# Altium schematic sheet SingleBoardDrone_Act.SchDoc
size C; SheetNumber: 3; SheetTotal: 5
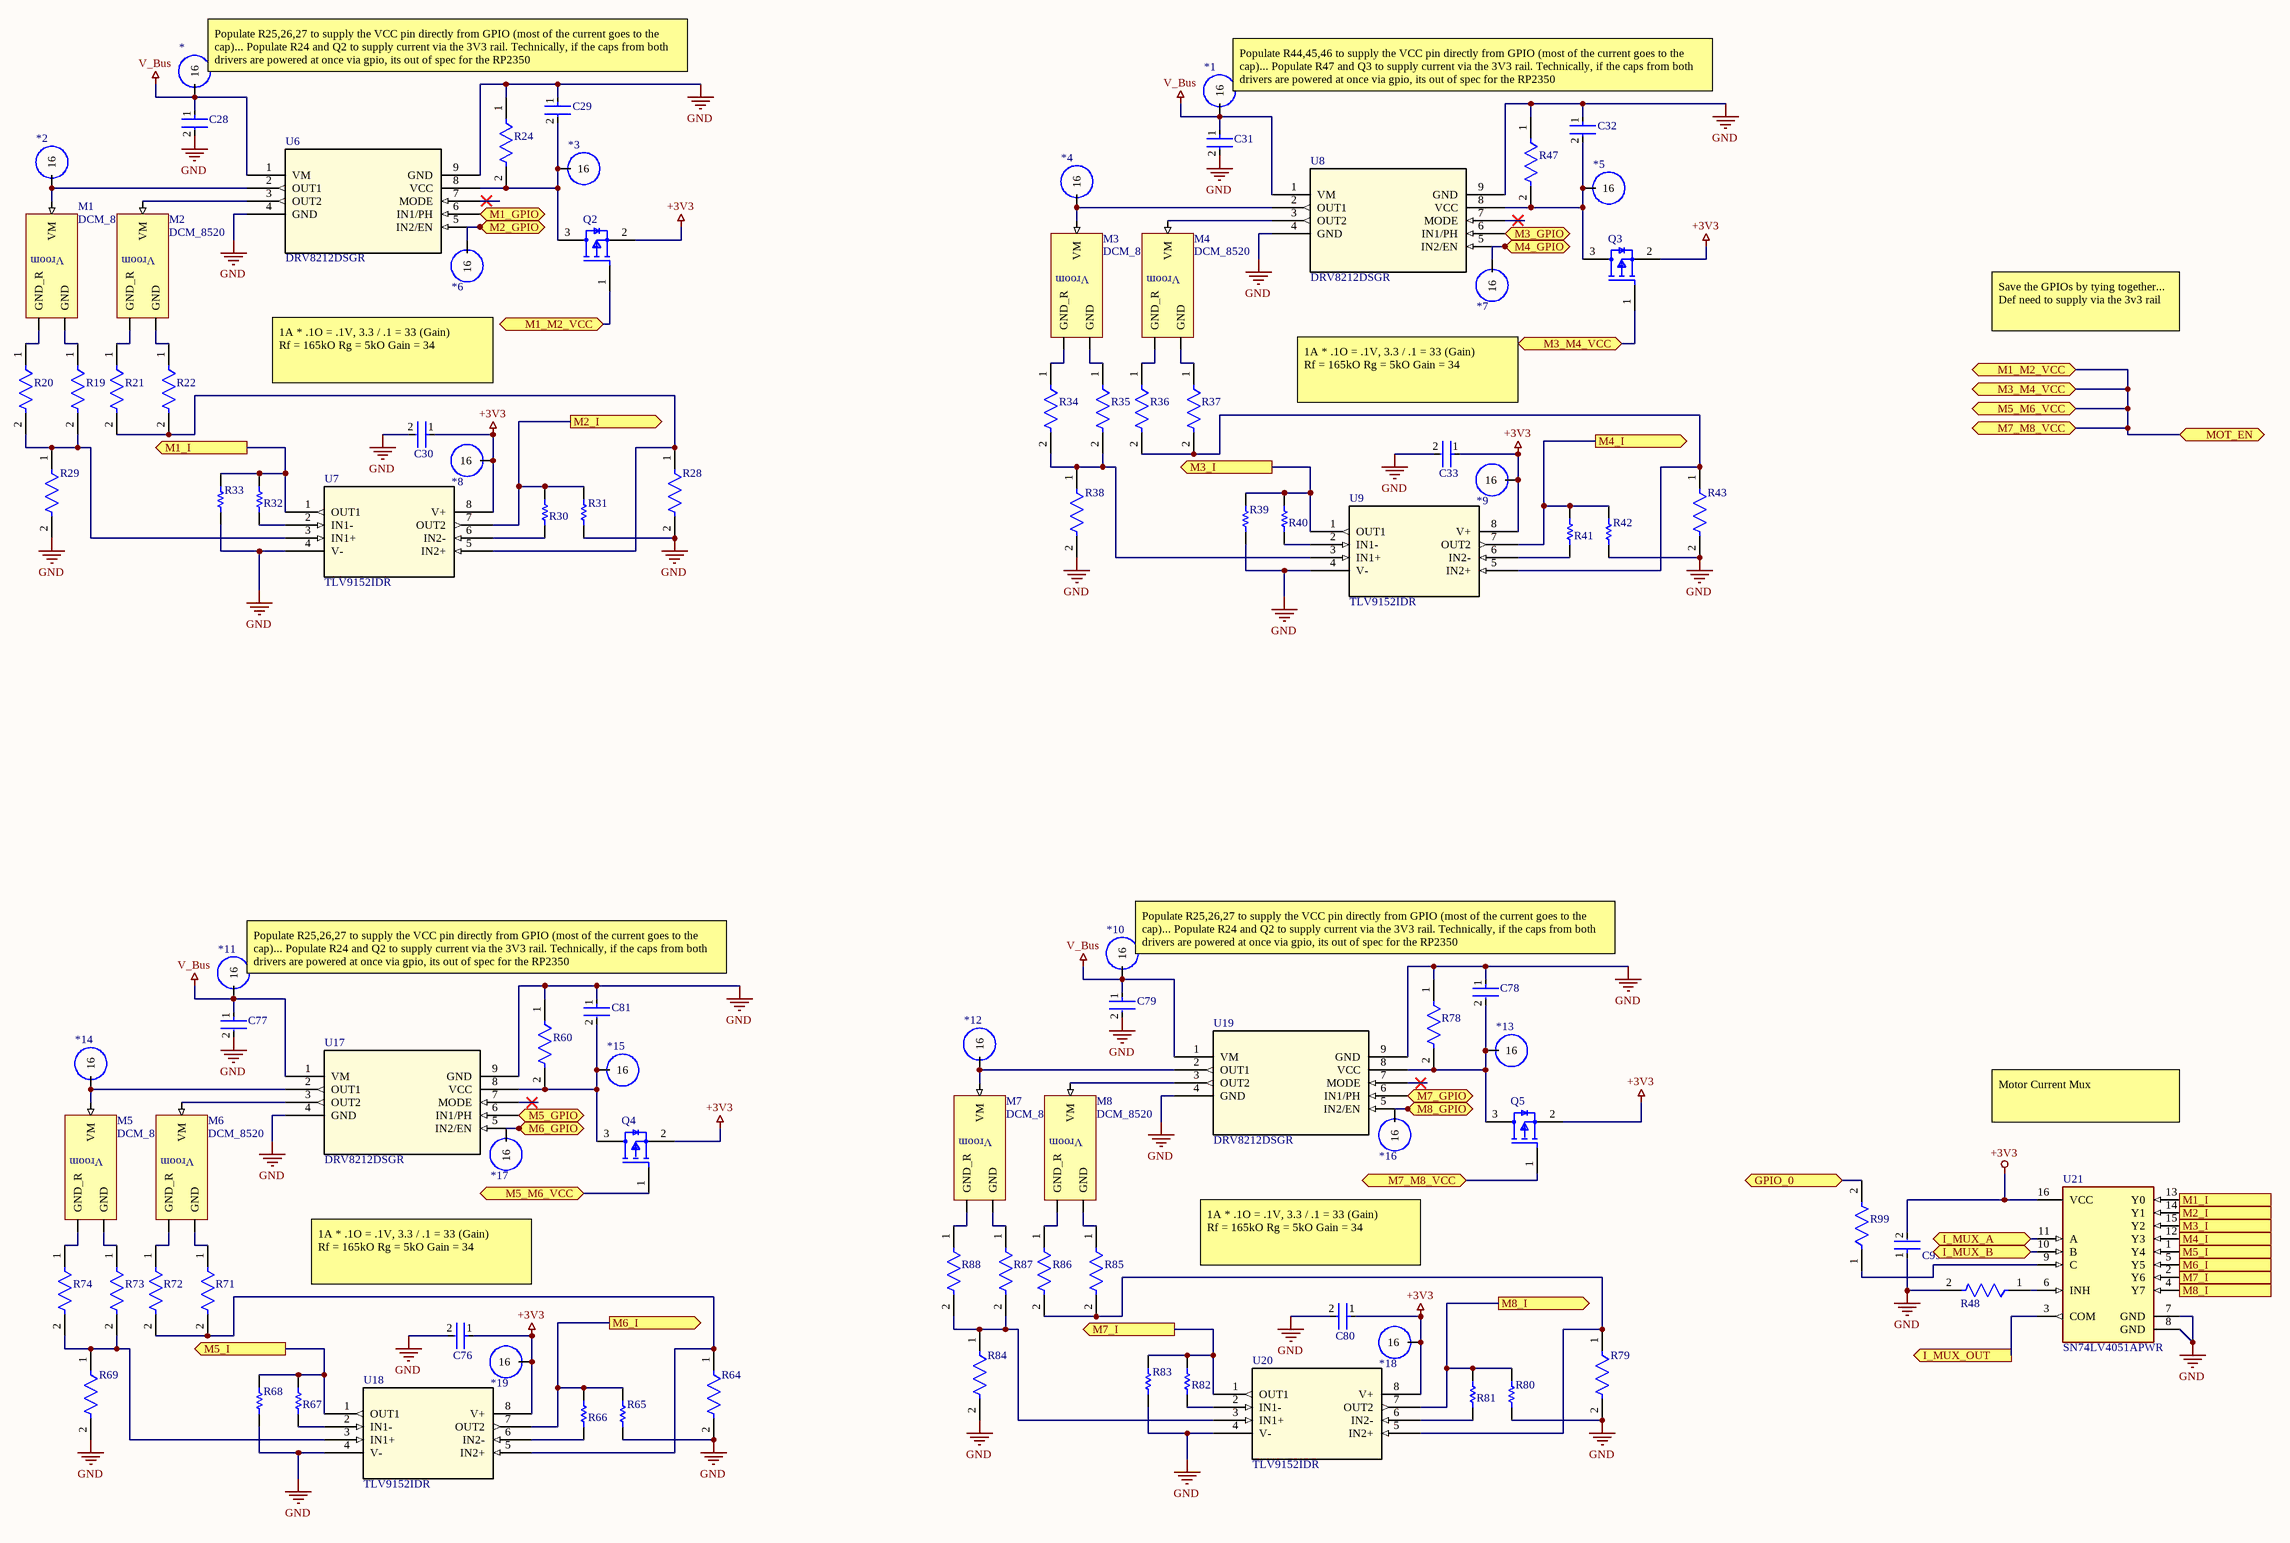
[diagram p0: SingleBoardDrone_Act.SchDoc]

## Parts
*  Component_1  [Test_Point]  (value not drawn)  (no BOM)
*1  Component_1  [Test_Point]  (value not drawn)  (no BOM)
*2  Component_1  [Test_Point]  (value not drawn)  (no BOM)
*3  Component_1  [Test_Point]  (value not drawn)  (no BOM)
*4  Component_1  [Test_Point]  (value not drawn)  (no BOM)
*5  Component_1  [Test_Point]  (value not drawn)  (no BOM)
*6  Component_1  [Test_Point]  (value not drawn)  (no BOM)
*7  Component_1  [Test_Point]  (value not drawn)  (no BOM)
*8  Component_1  [Test_Point]  (value not drawn)  (no BOM)
*9  Component_1  [Test_Point]  (value not drawn)  (no BOM)
*10  Component_1  [Test_Point]  (value not drawn)  (no BOM)
*11  Component_1  [Test_Point]  (value not drawn)  (no BOM)
*12  Component_1  [Test_Point]  (value not drawn)  (no BOM)
*13  Component_1  [Test_Point]  (value not drawn)  (no BOM)
*14  Component_1  [Test_Point]  (value not drawn)  (no BOM)
*15  Component_1  [Test_Point]  (value not drawn)  (no BOM)
*16  Component_1  [Test_Point]  (value not drawn)  (no BOM)
*17  Component_1  [Test_Point]  (value not drawn)  (no BOM)
*18  Component_1  [Test_Point]  (value not drawn)  (no BOM)
*19  Component_1  [Test_Point]  (value not drawn)  (no BOM)
C28  CL03A104KP3NNNC  [FP-CL03-IPC_C]  (value not drawn)
C29  CL03A104KP3NNNC  [FP-CL03-IPC_C]  (value not drawn)
C30  CL03A104KP3NNNC  [FP-CL03-IPC_C]  (value not drawn)
C31  CL03A104KP3NNNC  [FP-CL03-IPC_C]  (value not drawn)
C32  CL03A104KP3NNNC  [FP-CL03-IPC_C]  (value not drawn)
C33  CL03A104KP3NNNC  [FP-CL03-IPC_C]  (value not drawn)
C76  CL03A104KP3NNNC  [FP-CL03-IPC_C]  (value not drawn)
C77  CL03A104KP3NNNC  [FP-CL03-IPC_C]  (value not drawn)
C78  CL03A104KP3NNNC  [FP-CL03-IPC_C]  (value not drawn)
C79  CL03A104KP3NNNC  [FP-CL03-IPC_C]  (value not drawn)
C80  CL03A104KP3NNNC  [FP-CL03-IPC_C]  (value not drawn)
C81  CL03A104KP3NNNC  [FP-CL03-IPC_C]  (value not drawn)
C99  CL03A104KP3NNNC  [FP-CL03-IPC_C]  (value not drawn)
M1  DCM_8520  [PCBComponent_1]  (no BOM)
M2  DCM_8520  [PCBComponent_1]  (no BOM)
M3  DCM_8520  [PCBComponent_1]  (no BOM)
M4  DCM_8520  [PCBComponent_1]  (no BOM)
M5  DCM_8520  [PCBComponent_1]  (no BOM)
M6  DCM_8520  [PCBComponent_1]  (no BOM)
M7  DCM_8520  [PCBComponent_1]  (no BOM)
M8  DCM_8520  [PCBComponent_1]  (no BOM)
Q2  DMG2305UX-7  [FP-SOT23-IPC_B]  (value not drawn)
Q3  DMG2305UX-7  [FP-SOT23-IPC_B]  (value not drawn)
Q4  DMG2305UX-7  [FP-SOT23-IPC_B]  (value not drawn)
Q5  DMG2305UX-7  [FP-SOT23-IPC_B]  (value not drawn)
R19  RC0402FR-070RL  [FP-RC0402-0_4-IPC_A]  (value not drawn)
R20  RC0402FR-070RL  [FP-RC0402-0_4-IPC_A]  (value not drawn)
R21  RC0402FR-070RL  [FP-RC0402-0_4-IPC_A]  (value not drawn)
R22  RC0402FR-070RL  [FP-RC0402-0_4-IPC_A]  (value not drawn)
R24  RMCF0603JG10K0  [FP-RMCF0603-MFG]  (value not drawn)
R28  ERJ-3RSFR10V  [FP-ERJ3R-MFG]  (value not drawn)
R29  ERJ-3RSFR10V  [FP-ERJ3R-MFG]  (value not drawn)
R30  ERJ-3EKF1653V  [RESC1608X55X30LL15T15]  (value not drawn)
R31  CRCW08055K00FKTA  [RESC2013X50X30ML20T20]  (value not drawn)
R32  ERJ-3EKF1653V  [RESC1608X55X30LL15T15]  (value not drawn)
R33  CRCW08055K00FKTA  [RESC2013X50X30ML20T20]  (value not drawn)
R34  RC0402FR-070RL  [FP-RC0402-0_4-IPC_A]  (value not drawn)
R35  RC0402FR-070RL  [FP-RC0402-0_4-IPC_A]  (value not drawn)
R36  RC0402FR-070RL  [FP-RC0402-0_4-IPC_A]  (value not drawn)
R37  RC0402FR-070RL  [FP-RC0402-0_4-IPC_A]  (value not drawn)
R38  ERJ-3RSFR10V  [FP-ERJ3R-MFG]  (value not drawn)
R39  CRCW08055K00FKTA  [RESC2013X50X30ML20T20]  (value not drawn)
R40  ERJ-3EKF1653V  [RESC1608X55X30LL15T15]  (value not drawn)
R41  ERJ-3EKF1653V  [RESC1608X55X30LL15T15]  (value not drawn)
R42  CRCW08055K00FKTA  [RESC2013X50X30ML20T20]  (value not drawn)
R43  ERJ-3RSFR10V  [FP-ERJ3R-MFG]  (value not drawn)
R47  RMCF0603JG10K0  [FP-RMCF0603-MFG]  (value not drawn)
R48  RC0402FR-070RL  [FP-RC0402-0_4-IPC_A]  (value not drawn)
R60  RMCF0603JG10K0  [FP-RMCF0603-MFG]  (value not drawn)
R64  ERJ-3RSFR10V  [FP-ERJ3R-MFG]  (value not drawn)
R65  CRCW08055K00FKTA  [RESC2013X50X30ML20T20]  (value not drawn)
R66  ERJ-3EKF1653V  [RESC1608X55X30LL15T15]  (value not drawn)
R67  ERJ-3EKF1653V  [RESC1608X55X30LL15T15]  (value not drawn)
R68  CRCW08055K00FKTA  [RESC2013X50X30ML20T20]  (value not drawn)
R69  ERJ-3RSFR10V  [FP-ERJ3R-MFG]  (value not drawn)
R71  RC0402FR-070RL  [FP-RC0402-0_4-IPC_A]  (value not drawn)
R72  RC0402FR-070RL  [FP-RC0402-0_4-IPC_A]  (value not drawn)
R73  RC0402FR-070RL  [FP-RC0402-0_4-IPC_A]  (value not drawn)
R74  RC0402FR-070RL  [FP-RC0402-0_4-IPC_A]  (value not drawn)
R78  RMCF0603JG10K0  [FP-RMCF0603-MFG]  (value not drawn)
R79  ERJ-3RSFR10V  [FP-ERJ3R-MFG]  (value not drawn)
R80  CRCW08055K00FKTA  [RESC2013X50X30ML20T20]  (value not drawn)
R81  ERJ-3EKF1653V  [RESC1608X55X30LL15T15]  (value not drawn)
R82  ERJ-3EKF1653V  [RESC1608X55X30LL15T15]  (value not drawn)
R83  CRCW08055K00FKTA  [RESC2013X50X30ML20T20]  (value not drawn)
R84  ERJ-3RSFR10V  [FP-ERJ3R-MFG]  (value not drawn)
R85  RC0402FR-070RL  [FP-RC0402-0_4-IPC_A]  (value not drawn)
R86  RC0402FR-070RL  [FP-RC0402-0_4-IPC_A]  (value not drawn)
R87  RC0402FR-070RL  [FP-RC0402-0_4-IPC_A]  (value not drawn)
R88  RC0402FR-070RL  [FP-RC0402-0_4-IPC_A]  (value not drawn)
R99  RC0402FR-070RL  [FP-RC0402-0_4-IPC_A]  (value not drawn)
U6  DRV8212DSGR  [WSON_212DSGR_TEX]
U7  TLV9152IDR  [SOIC8_D_TEX]
U8  DRV8212DSGR  [WSON_212DSGR_TEX]
U9  TLV9152IDR  [SOIC8_D_TEX]
U17  DRV8212DSGR  [WSON_212DSGR_TEX]
U18  TLV9152IDR  [SOIC8_D_TEX]
U19  DRV8212DSGR  [WSON_212DSGR_TEX]
U20  TLV9152IDR  [SOIC8_D_TEX]
U21  SN74LV4051APWR  [FP-PW0016A-MFG]

## Ports
GPIO_0 (bidir, see SingleBoardDrone_RP2350[1A], SingleBoardDrone_RP2350[2C]), I_MUX_A (bidir, see SingleBoardDrone_RP2350[1A]), I_MUX_B (bidir, see SingleBoardDrone_RP2350[3B]), I_MUX_OUT (out, see SingleBoardDrone_RP2350[3B]), M1_GPIO (bidir, see SingleBoardDrone_RP2350[1A]), M1_I (out, see SingleBoardDrone_Act[1B]), M1_I (out, see SingleBoardDrone_Act[6C]), M1_M2_VCC (bidir, see SingleBoardDrone_Act[2A]), M1_M2_VCC (bidir, see SingleBoardDrone_Act[5A]), M2_GPIO (bidir, see SingleBoardDrone_RP2350[1A]), M2_I (out, see SingleBoardDrone_Act[2B]), M2_I (out, see SingleBoardDrone_Act[6C]), M3_GPIO (bidir, see SingleBoardDrone_RP2350[1B]), M3_I (out, see SingleBoardDrone_Act[3B]), M3_I (out, see SingleBoardDrone_Act[6C]), M3_M4_VCC (bidir, see SingleBoardDrone_Act[4A]), M3_M4_VCC (bidir, see SingleBoardDrone_Act[5B]), M4_GPIO (bidir, see SingleBoardDrone_RP2350[1B]), M4_I (out, see SingleBoardDrone_Act[4B]), M4_I (out, see SingleBoardDrone_Act[6C]), M5_GPIO (bidir, see SingleBoardDrone_RP2350[1B]), M5_I (out, see SingleBoardDrone_Act[1C]), M5_I (out, see SingleBoardDrone_Act[6C]), M5_M6_VCC (bidir, see SingleBoardDrone_Act[2C]), M5_M6_VCC (bidir, see SingleBoardDrone_Act[5B]), M6_GPIO (bidir, see SingleBoardDrone_RP2350[1B]), M6_I (out, see SingleBoardDrone_Act[2C]), M6_I (out, see SingleBoardDrone_Act[6C]), M7_GPIO (bidir, see SingleBoardDrone_RP2350[1B]), M7_I (out, see SingleBoardDrone_Act[3C]), M7_I (out, see SingleBoardDrone_Act[6C]), M7_M8_VCC (bidir, see SingleBoardDrone_Act[4C]), M7_M8_VCC (bidir, see SingleBoardDrone_Act[5B]), M8_GPIO (bidir, see SingleBoardDrone_RP2350[1B]), M8_I (out, see SingleBoardDrone_Act[4C]), M8_I (out, see SingleBoardDrone_Act[6C]), MOT_EN (bidir, see SingleBoardDrone_RP2350[3B])

## Nets
+3V3: *8.TP1(16) *9.TP1(16) *18.TP1(16) *19.TP1(16) C30.1 C33.1 C76.1 C80.1 C99.2 Q2.2(SOURCE) Q3.2(SOURCE) Q4.2(SOURCE) Q5.2(SOURCE) U7.8(V+) U9.8(V+) U18.8(V+) U20.8(V+) U21.16(VCC)
GND: C28.2 C29.1 C30.2 C31.2 C32.1 C33.2 C76.2 C77.2 C78.1 C79.2 C80.2 C81.1 C99.1 R24.1 R28.2 R29.2 R31.2 R33.2 R38.2 R39.2 R42.2 R43.2 R47.1 R48.2 R60.1 R64.2 R65.2 R68.2 R69.2 R78.1 R79.2 R80.2 R83.2 R84.2 U6.4(GND) U6.9(GND) U7.4(V-) U8.4(GND) U8.9(GND) U9.4(V-) U17.4(GND) U17.9(GND) U18.4(V-) U19.4(GND) U19.9(GND) U20.4(V-) U21.7(GND) U21.8(GND)
V_Bus: *.TP1(16) *1.TP1(16) *10.TP1(16) *11.TP1(16) C28.1 C31.1 C77.1 C79.1 U6.1(VM) U8.1(VM) U17.1(VM) U19.1(VM)
GPIO_0: R99.2 ; port GPIO_0
I_MUX_A: U21.11(A) ; port I_MUX_A
I_MUX_B: U21.10(B) ; port I_MUX_B
I_MUX_OUT: U21.3(COM) ; port I_MUX_OUT
M1_GPIO: U6.6(IN1/PH) ; port M1_GPIO
M1_I: R32.1 R33.1 U7.1(OUT1) U21.13(Y0) ; port M1_I
M1_M2_VCC: Q2.1(GATE) Q3.1(GATE) Q4.1(GATE) Q5.1(GATE) ; port M1_M2_VCC, port M3_M4_VCC, port M5_M6_VCC, port M7_M8_VCC, port MOT_EN
M2_GPIO: *6.TP1(16) U6.5(IN2/EN) ; port M2_GPIO
M2_I: R30.1 R31.1 U7.7(OUT2) U21.14(Y1) ; port M2_I
M3_GPIO: U8.6(IN1/PH) ; port M3_GPIO
M3_I: R39.1 R40.1 U9.1(OUT1) U21.15(Y2) ; port M3_I
M4_GPIO: *7.TP1(16) U8.5(IN2/EN) ; port M4_GPIO
M4_I: R41.1 R42.1 U9.7(OUT2) U21.12(Y3) ; port M4_I
M5_GPIO: U17.6(IN1/PH) ; port M5_GPIO
M5_I: R67.1 R68.1 U18.1(OUT1) U21.1(Y4) ; port M5_I
M6_GPIO: *17.TP1(16) U17.5(IN2/EN) ; port M6_GPIO
M6_I: R65.1 R66.1 U18.7(OUT2) U21.5(Y5) ; port M6_I
M7_GPIO: U19.6(IN1/PH) ; port M7_GPIO
M7_I: R82.1 R83.1 U20.1(OUT1) U21.2(Y6) ; port M7_I
M8_GPIO: *16.TP1(16) U19.5(IN2/EN) ; port M8_GPIO
M8_I: R80.1 R81.1 U20.7(OUT2) U21.4(Y7) ; port M8_I
Net*2_TP1: *2.TP1(16) M1.VM U6.2(OUT1)
Net*3_TP1: *3.TP1(16) C29.2 Q2.3(DRAIN) R24.2 U6.8(VCC)
Net*4_TP1: *4.TP1(16) M3.VM U8.2(OUT1)
Net*5_TP1: *5.TP1(16) C32.2 Q3.3(DRAIN) R47.2 U8.8(VCC)
Net*12_TP1: *12.TP1(16) M7.VM U19.2(OUT1)
Net*13_TP1: *13.TP1(16) C78.2 Q5.3(DRAIN) R78.2 U19.8(VCC)
Net*14_TP1: *14.TP1(16) M5.VM U17.2(OUT1)
Net*15_TP1: *15.TP1(16) C81.2 Q4.3(DRAIN) R60.2 U17.8(VCC)
NetM1_GND: M1.GND R19.1
NetM1_GND_R: M1.GND_R R20.1
NetM2_GND: M2.GND R22.1
NetM2_GND_R: M2.GND_R R21.1
NetM2_VM: M2.VM U6.3(OUT2)
NetM3_GND: M3.GND R35.1
NetM3_GND_R: M3.GND_R R34.1
NetM4_GND: M4.GND R37.1
NetM4_GND_R: M4.GND_R R36.1
NetM4_VM: M4.VM U8.3(OUT2)
NetM5_GND: M5.GND R73.1
NetM5_GND_R: M5.GND_R R74.1
NetM6_GND: M6.GND R71.1
NetM6_GND_R: M6.GND_R R72.1
NetM6_VM: M6.VM U17.3(OUT2)
NetM7_GND: M7.GND R87.1
NetM7_GND_R: M7.GND_R R88.1
NetM8_GND: M8.GND R85.1
NetM8_GND_R: M8.GND_R R86.1
NetM8_VM: M8.VM U19.3(OUT2)
NetR19_2: R19.2 R20.2 R29.1 U7.3(IN1+)
NetR21_2: R21.2 R22.2 R28.1 U7.5(IN2+)
NetR30_2: R30.2 U7.6(IN2-)
NetR32_2: R32.2 U7.2(IN1-)
NetR34_2: R34.2 R35.2 R38.1 U9.3(IN1+)
NetR36_2: R36.2 R37.2 R43.1 U9.5(IN2+)
NetR40_2: R40.2 U9.2(IN1-)
NetR41_2: R41.2 U9.6(IN2-)
NetR48_1: R48.1 U21.6(INH)
NetR64_1: R64.1 R71.2 R72.2 U18.5(IN2+)
NetR66_2: R66.2 U18.6(IN2-)
NetR67_2: R67.2 U18.2(IN1-)
NetR69_1: R69.1 R73.2 R74.2 U18.3(IN1+)
NetR79_1: R79.1 R85.2 R86.2 U20.5(IN2+)
NetR81_2: R81.2 U20.6(IN2-)
NetR82_2: R82.2 U20.2(IN1-)
NetR84_1: R84.1 R87.2 R88.2 U20.3(IN1+)
NetR99_1: R99.1 U21.9(C)

Not connected (* = marked no-connect by the designer): U6 7(MODE)*; U8 7(MODE)*; U17 7(MODE)*; U19 7(MODE)*

## Notes on the sheet
- (near *) Populate R25,26,27 to supply the VCC pin directly from GPIO (most of the current goes to the cap)... Populate R24 and Q2 to supply current via the 3V3 rail. Technically, if the caps from both drivers are powered at once via gpio, its out of spec for the RP2350
- (near *1) Populate R44,45,46 to supply the VCC pin directly from GPIO (most of the current goes to the cap)... Populate R47 and Q3 to supply current via the 3V3 rail. Technically, if the caps from both drivers are powered at once via gpio, its out of spec for the RP2350
- Save the GPIOs by tying together... Def need to supply via the 3v3 rail
- 1A * .1O = .1V, 3.3 / .1 = 33 (Gain)
  Rf = 165kO Rg = 5kO Gain = 34
- (near *10) Populate R25,26,27 to supply the VCC pin directly from GPIO (most of the current goes to the cap)... Populate R24 and Q2 to supply current via the 3V3 rail. Technically, if the caps from both drivers are powered at once via gpio, its out of spec for the RP2350
- (near *11) Populate R25,26,27 to supply the VCC pin directly from GPIO (most of the current goes to the cap)... Populate R24 and Q2 to supply current via the 3V3 rail. Technically, if the caps from both drivers are powered at once via gpio, its out of spec for the RP2350
- Motor Current Mux
- (in symbol DCM_8520) Vroom

## Library data of the parts
C28-C33 C76-C81 C99 = CMP-2010-00672-2: Cap Ceramic 100nF 10V X5R ±10% Pad SMD 0201 +85°C T/R; Radiation Hardening: No; Voltage Rating: 10V; Dielectric: X5R; Length: 0.6mm; Voltage Rating (DC): 10V; Package Quantity: 1; Height: 0.3mm; Width: 0.012inch; Min Operating Temperature: -55°C; Lead Free: Lead Free; Tolerance: 10%; Contact Plating: Tin; Depth: 0.3mm; Max Operating Temperature: 85°C; Case/Package: 0201; Capacitance: 100nF; Mount: Surface Mount; Thickness: 0.013inch; Case Code (Metric): 0603; Case Code (Imperial): 0201; Packaging: Tape and Reel
M1-M8 = DCM_8520: 8520 DC Motor
Q2-Q5 = CMP-1693-00002-4: MOSFET P-CH 20V 4.2A SOT23; Turn-On Delay Time: 10.8ns; Turn-Off Delay Time: 79.3ns; Threshold Voltage: -900mV; Rise Time: 13.7ns; Gate to Source Voltage (Vgs): 8V; Rds On Max: 52mR; Element Configuration: Single; Fall Time: 34.7ns; Max Power Dissipation: 1.4W; Drain to Source Resistance: 200mR; Number of Channels: 1; Input Capacitance: 808pF; Lead Free: Lead Free; Number of Pins: 3; Length: 3mm; Continuous Drain Current (ID): 4.2A; Contact Plating: Tin; Mount: Surface Mount; Weight: 0.000282oz; Min Operating Temperature: -55°C; Package Quantity: 3000; Drain to Source Voltage (Vdss): 20V; On-State Resistance: 52MR; Max Operating Temperature: 150°C; Height: 1.1mm; REACH SVHC: No SVHC; Packaging: Tape and Reel; Radiation Hardening: No; Case/Package: SOT-23; Width: 1.4mm
R19-R22 R34-R37 R48 R71-R74 R85-R88 R99 = CMP-2002-07342-2: RES SMD 0 OHM JUMPER 1/16W 0402; Resistance: 0R; Temperature Coefficient: 200ppm/°C; Tolerance: 1%; Power Rating: 62.5mW; Voltage Rating: 50V; Max Power Dissipation: 63mW; Features: Moisture Resistant; Length: 1mm; Case Code (Metric): 1005; Series: RC; RoHS Compliant: Yes; Resistor Type: Thick Film; Height: 0.35mm; Min Operating Temperature: -55°C; Case Code (Imperial): 0402; Number of Terminations: 2; Contact Plating: Tin; Case/Package: 0402; Size Code: 0402; Termination: SMD/SMT; Max Operating Temperature: 155°C; Width: 0.5mm; Mount: Surface Mount; Lead Free: Lead Free; Packaging: Tape and Reel; Radiation Hardening: No
R24 R47 R60 R78 = CMP-26527-000153-1: 10kΩ ±5% 0.1W 0603 Thick Film Chip Resistor AEC-Q200 compliant; Temperature Coefficient: 200ppm/°C; Resistance: 10kR; Max Power Dissipation: 100mW; Tolerance: 5%; Case Code (Imperial): 0603; Series: RMCF; Resistor Type: Thick Film; Length: 0.061inch; Features: Automotive AEC-Q200; Height: 0.022inch; Case Code (Metric): 1608; Width: 0.031inch; Number of Terminations: 2; Contact Plating: Tin; Case/Package: 0603; Package Quantity: 1; Max Operating Temperature: 155°C; Mount: Surface Mount; RoHS Compliant: Yes; Radiation Hardening: No; Min Operating Temperature: -55°C; Packaging: Tape and Reel
R28 R29 R38 R43 R64 R69 R79 R84 = CMP-2000-00862-2: RES 0.1 OHM 1% 1/10W 0603; Resistance: 100mR; Power Rating: 100mW; Temperature Coefficient: 300ppm/°C; Termination: SMD/SMT; Height: 0.45mm; Tolerance: 1%; Resistor Type: Thick Film; Package Quantity: 5000; Case/Package: 0603; Case Code (Metric): 1608; Lead Free: Lead Free; Military Standard: Not; Min Operating Temperature: -55°C; Construction: Rectangular; Resistance Tolerance: 1%; REACH SVHC: No SVHC; RoHS Compliant: Yes; Series: ERJ; Number of Terminations: 2; Number of Pins: 2; Length: 1.6mm; Mount: Surface Mount; Max Power Dissipation: 100mW; Width: 0.031inch; Case Code (Imperial): 0603; Contact Plating: Tin; Packaging: Tape and Reel; Radiation Hardening: No; Size Code: 0603; Technology: THICK FILM; Max Operating Temperature: 125°C; Depth: 0.8mm
R30 R32 R40 R41 R66 R67 R81 R82 = CMP-2000-00280-1: Manufacturer: Panasonic; Part Number: ERJ-3EKF1653V
R31 R33 R39 R42 R65 R68 R80 R83 = CMP-2001-04239-1: Manufacturer: Vishay Dale; Part Number: CRCW08055K00FKTA
U6 U8 U17 U19 = DRV8212DSGR: 12-V, 4-A H-bridge motor driver with auto sleep mode 8-WSON -40 to 125; Manufacturer_Name: Texas Instruments; Copyright: Copyright (C) 2025 Ultra Librarian. All rights reserved.; Manufacturer_Part_Number: DRV8212DSGR; Datasheet: https://www.ti.com/lit/gpn/drv8212; RefDes: RefDes; Type: Type
U7 U9 U18 U20 = TLV9152IDR: Dual, 16-V, 4.5-MHz, low-power operational amplifier 8-SOIC -40 to 125; Manufacturer_Name: Texas Instruments; Copyright: Copyright (C) 2025 Ultra Librarian. All rights reserved.; Manufacturer_Part_Number: TLV9152IDR; Datasheet: https://www.ti.com/lit/gpn/tlv9152; RefDes: RefDes; Type: Type
U21 = CMP-0802-00044-5: IC MUX/DEMUX 8X1 16TSSOP; Manufacturer: Texas Instruments; Max Junction Temp: +150°C; Max Supply Voltage: 5.5V; Min Supply Voltage: 2V; Mux Demux Ratio: 8:1; Standoff Height: 0.05mm; On State Resistance: 22Ω; Nominal Supply Current: 20uA; -3Db Bandwith: 35MHz; Number Of Circuits: 1; Ambient Temperature Range Low: -40°C; Ambient Temperature Range High: +85°C; Device Class L3: Multiplexers; ComponentLink2URL: http://www.ti.com/lit/ds/symlink/sn74lv4051a.pdf; Lead Free: Yes; Category: IC; Octopart: https://octopart.com/sn74lv4051apwr-texas+instruments-472550; Temperature Range High: +85°C; Temperature: -40°C to +85°C; Ipc Land Pattern Name: SOP65P640X120-16; Device Class L1: Integrated Circuits (ICs); Height: 1.2mm; Mouser Description: Multiplexer Switch ICs 8-Channel Analog; Digikey Description: IC MUX/DEMUX 8X1 16TSSOP; Device Class L2: Interface ICs; Automotive: No; Package: PW0016A; ComponentLink2Description: Datasheet; RoHS: TRUE; Temperature Range Low: -40°C; Manufacturer Part Number: SN74LV4051APWR